# EAGLE design E_Arduino_MEGA2560_ref (EAGLE 6.5.0)
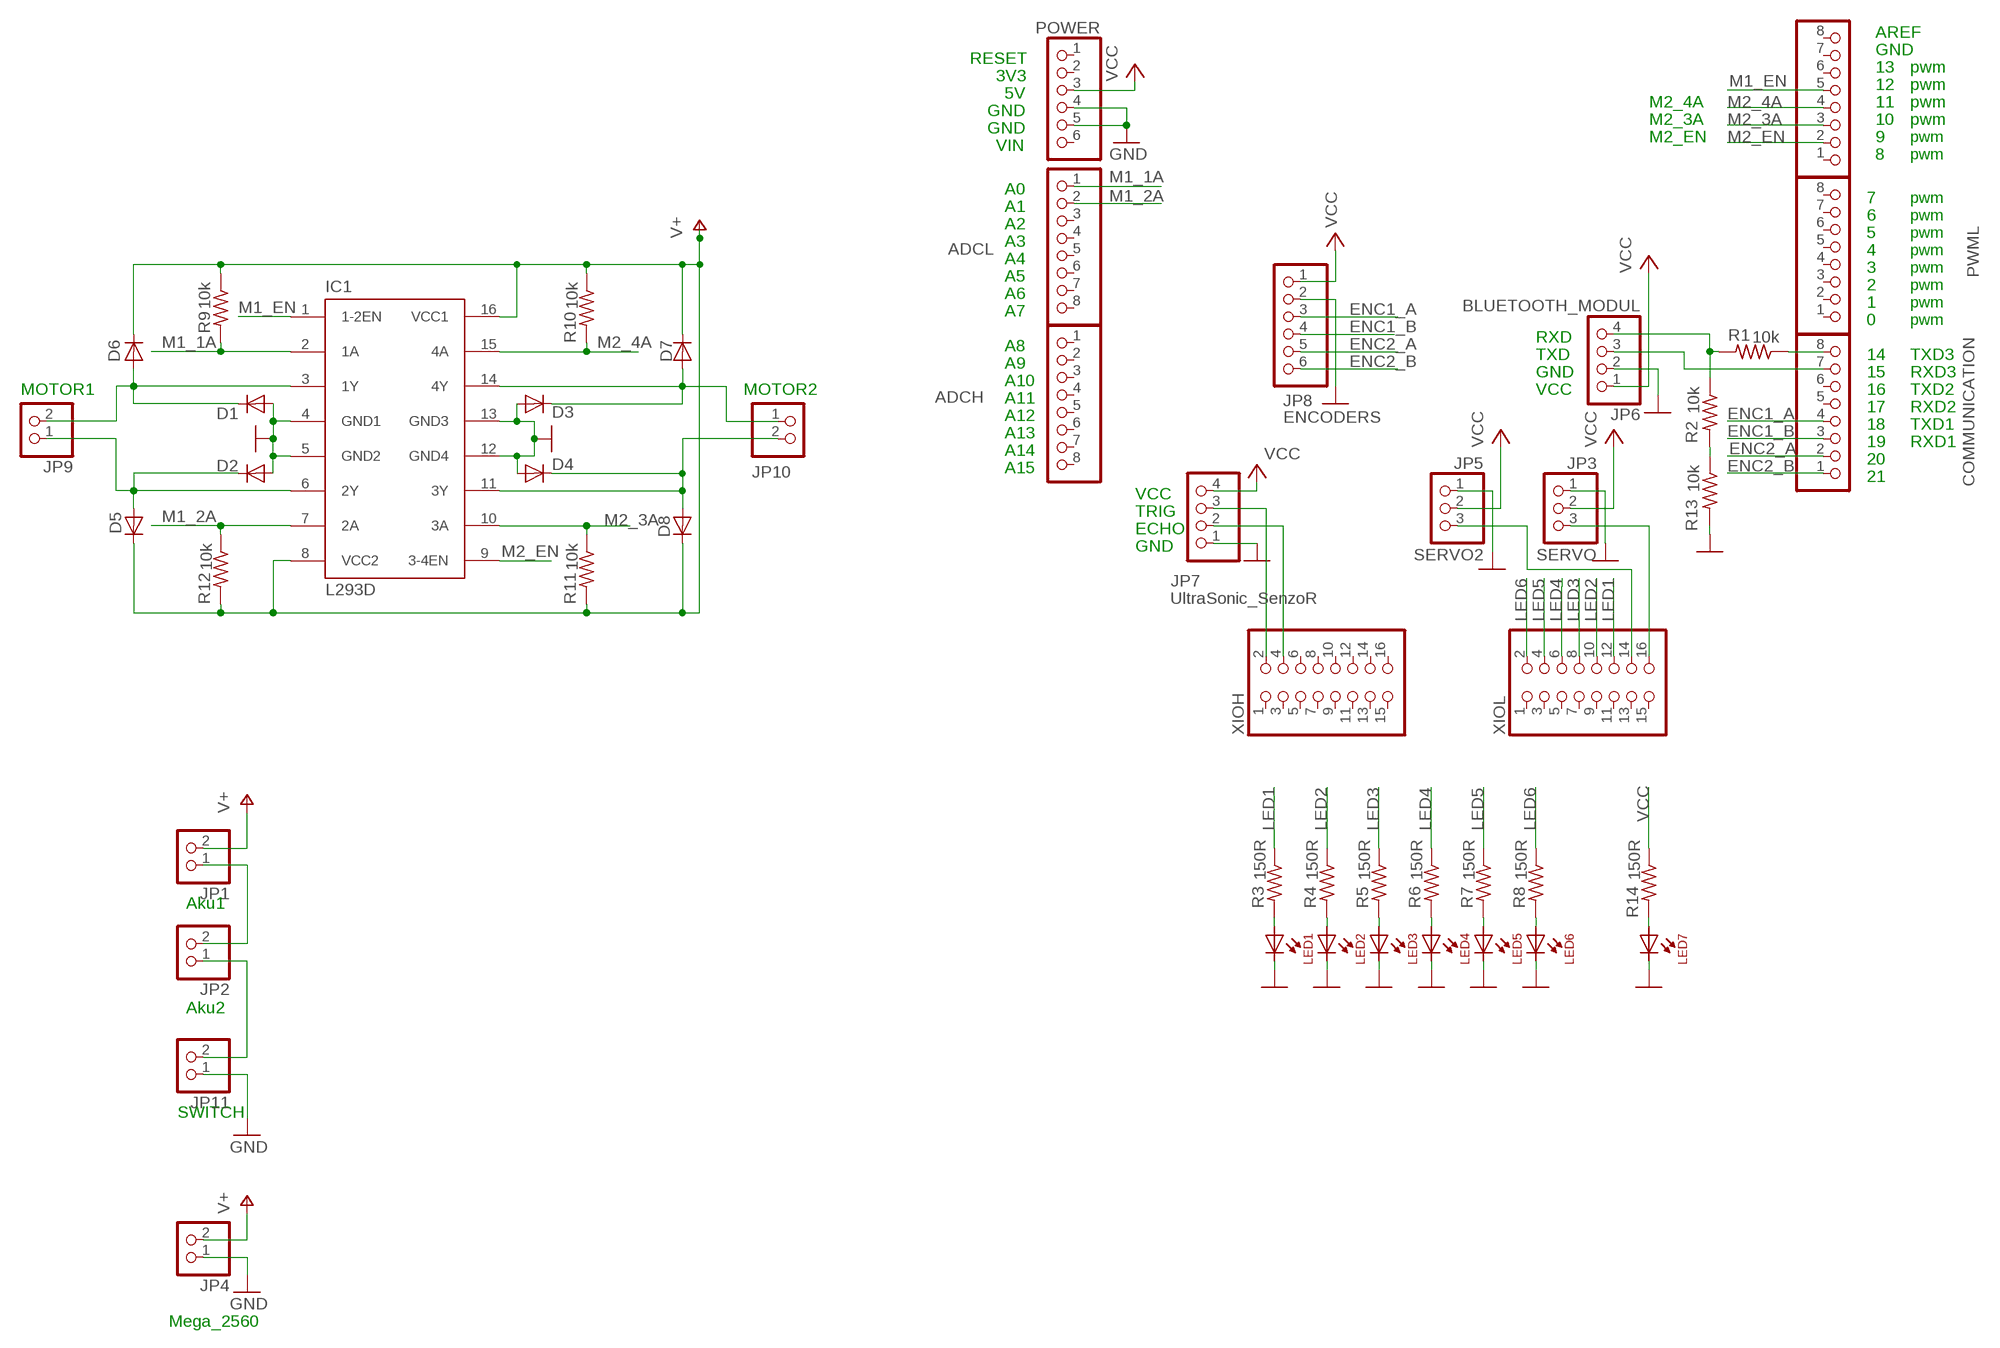
[diagram p0: schematic, sheet 1]

## Parts
ADCH  PINHD-1X8  [1X08]
ADCL  PINHD-1X8  [1X08]
COMMUNICATION  PINHD-1X8  [1X08]
D1  PMLL4150  [SOD80C]
D2  PMLL4150  [SOD80C]
D3  PMLL4150  [SOD80C]
D4  PMLL4150  [SOD80C]
D5  PMLL4150  [SOD80C]
D6  PMLL4150  [SOD80C]
D7  PMLL4150  [SOD80C]
D8  PMLL4150  [SOD80C]
IC1  L293D  [DIL16]
JP1  PINHD-1X2  [1X02]
JP2  PINHD-1X2  [1X02]
JP3  SERVO  PINHD-1X3  [1X03]
JP4  PINHD-1X2  [1X02]
JP5  SERVO2  PINHD-1X3  [1X03]
JP6  BLUETOOTH_MODUL  PINHD-1X4  [1X04]
JP7  UltraSonic_SenzoR  PINHD-1X4  [1X04]
JP8  ENCODERS  PINHD-1X6  [1X06]
JP9  PINHD-1X2  [1X02]
JP10  PINHD-1X2  [1X02]
JP11  PINHD-1X2  [1X02]
LED1  LED_Y_SMD  [LED_Y_SMD]
LED2  LED_Y_SMD  [LED_Y_SMD]
LED3  LED_Y_SMD  [LED_Y_SMD]
LED4  LED_Y_SMD  [LED_Y_SMD]
LED5  LED_Y_SMD  [LED_Y_SMD]
LED6  LED_Y_SMD  [LED_Y_SMD]
LED7  LED_Y_SMD  [LED_Y_SMD]
POWER  PINHD-1X6  [1X06]
PWMH  PINHD-1X8  [1X08]
PWML  PINHD-1X8  [1X08]
R1  10k  R-US_R0805  [R0805]
R2  10k  R-US_R0805  [R0805]
R3  150R  R-US_R0805  [R0805]
R4  150R  R-US_R0805  [R0805]
R5  150R  R-US_R0805  [R0805]
R6  150R  R-US_R0805  [R0805]
R7  150R  R-US_R0805  [R0805]
R8  150R  R-US_R0805  [R0805]
R9  10k  R-US_R0805  [R0805]
R10  10k  R-US_R0805  [R0805]
R11  10k  R-US_R0805  [R0805]
R12  10k  R-US_R0805  [R0805]
R13  10k  R-US_R0805  [R0805]
R14  150R  R-US_R0805  [R0805]
XIOH  PINHD-2X8  [2X08]
XIOL  PINHD-2X8  [2X08]

## Nets
ENC1_A: COMMUNICATION.4 JP8.3
ENC1_B: COMMUNICATION.3 JP8.4
ENC2_A: COMMUNICATION.2 JP8.5
ENC2_B: COMMUNICATION.1 JP8.6
GND [Ground]: D1.A D2.A D3.A D4.A IC1.4(GND1) IC1.5(GND2) IC1.12(GND4) IC1.13(GND3) JP3.1 JP4.1 JP5.1 JP6.2 JP7.1 JP8.2 JP11.1 LED1.CATHODE LED2.CATHODE LED3.CATHODE LED4.CATHODE LED5.CATHODE LED6.CATHODE LED7.CATHODE POWER.4 POWER.5 R13.2
LED1: R3.1 XIOL.12
LED2: R4.1 XIOL.10
LED3: R5.1 XIOL.8
LED4: R6.1 XIOL.6
LED5: R7.1 XIOL.4
LED6: R8.1 XIOL.2
M1_1A: ADCL.1 IC1.2(1A) R9.2
M1_2A: ADCL.2 IC1.7(2A) R12.1
M1_EN: IC1.1(1-2EN) PWMH.5
M2_3A: IC1.10(3A) PWMH.3 R11.1
M2_4A: IC1.15(4A) PWMH.4 R10.2
M2_EN: IC1.9(3-4EN) PWMH.2
N$1: D1.C D6.A IC1.3(1Y) JP9.2
N$2: D2.C D5.A IC1.6(2Y) JP9.1
N$3: D3.C D7.A IC1.14(4Y) JP10.1
N$4: D4.C D8.A IC1.11(3Y) JP10.2
N$5: JP3.3 XIOL.16
N$6: COMMUNICATION.7 JP6.3
N$7: COMMUNICATION.8 R1.1
N$8: JP6.4 R1.2 R2.1
N$9: R2.2 R13.1
N$10: JP7.2 XIOH.4
N$11: JP7.3 XIOH.2
N$12: LED1.ANODE R3.2
N$13: LED2.ANODE R4.2
N$14: LED3.ANODE R5.2
N$15: LED4.ANODE R6.2
N$16: LED5.ANODE R7.2
N$17: LED6.ANODE R8.2
N$18: JP5.3 XIOL.14
N$19: LED7.ANODE R14.2
N$20 [Ground]: JP1.1 JP2.2
N$21 [Ground]: JP2.1 JP11.2
V+ [VCC_]: D5.C D6.C D7.C D8.C IC1.8(VCC2) IC1.16(VCC1) JP1.2 JP4.2 R9.1 R10.1 R11.2 R12.2
VCC [VCC_]: JP3.2 JP5.2 JP6.1 JP7.4 JP8.1 POWER.3 R14.1
Unconnected: ADCH.1 ADCH.2 ADCH.3 ADCH.4 ADCH.5 ADCH.6 ADCH.7 ADCH.8 ADCL.3 ADCL.4 ADCL.5 ADCL.6 ADCL.7 ADCL.8 COMMUNICATION.5 COMMUNICATION.6 POWER.1 POWER.2 POWER.6 PWMH.1 PWMH.6 PWMH.7 PWMH.8 PWML.1 PWML.2 PWML.3 PWML.4 PWML.5 PWML.6 PWML.7 PWML.8 XIOH.1 XIOH.3 XIOH.5 XIOH.6 XIOH.7 XIOH.8 XIOH.9 XIOH.10 XIOH.11 XIOH.12 XIOH.13 XIOH.14 XIOH.15 XIOH.16 XIOL.1 XIOL.3 XIOL.5 XIOL.7 XIOL.9 XIOL.11 XIOL.13 XIOL.15

## Notes on the sheet
- AREF
- GND
- RESET
- 13 | pwm
- 3V3
- 12 | pwm
- 5V
- M2_4A | 11 | pwm
- GND
- M2_3A | 10 | pwm
- GND
- M2_EN | 9 | pwm
- VIN
- 8 | pwm
- A0
- 7 | pwm
- A1
- 6 | pwm
- A2
- 5 | pwm
- A3
- 4 | pwm
- A4
- 3 | pwm
- A5
- 2 | pwm
- A6
- 1 | pwm
- A7
- 0 | pwm
- RXD
- A8
- TXD | 14 | TXD3
- A9
- GND | 15 | RXD3
- A10
- MOTOR1 | MOTOR2 | VCC | 16 | TXD2
- A11
- 17 | RXD2
- A12
- 18 | TXD1
- A13
- 19 | RXD1
- A14
- 20
- A15
- 21
- VCC
- TRIG
- ECHO
- GND
- Aku1
- Aku2
- SWITCH
- Mega_2560

## Library data of the parts
ADCH ADCL COMMUNICATION PWMH PWML = pinhead:PINHD-1X8: PIN HEADER
D1-D8 = diode:PMLL4150: DIODE high speed
IC1 = st-microelectronics:L293D: PUSH-PULL 4 CHANNEL DRIVER; MPN: L293D; OC_FARNELL: 9589619; OC_NEWARK: 56P8249
JP1 JP2 JP4 JP9-JP11 = pinhead:PINHD-1X2: PIN HEADER
JP3 JP5 = pinhead:PINHD-1X3: PIN HEADER
JP6 JP7 = pinhead:PINHD-1X4: PIN HEADER
JP8 POWER = pinhead:PINHD-1X6: PIN HEADER
LED1-LED7 = my_lib:LED_Y_SMD
R1-R14 = adafruit:R-US_: RESISTOR, American symbol
XIOH XIOL = pinhead:PINHD-2X8: PIN HEADER

## Net classes
0 default: width 0.508 mm, drill 20 mm, clearance 0.2 mm
1 Ground: width 1.016 mm, drill 20 mm, clearance 0.2 mm
2 VCC_: width 1.016 mm, drill 20 mm, clearance 0.2 mm

## Board
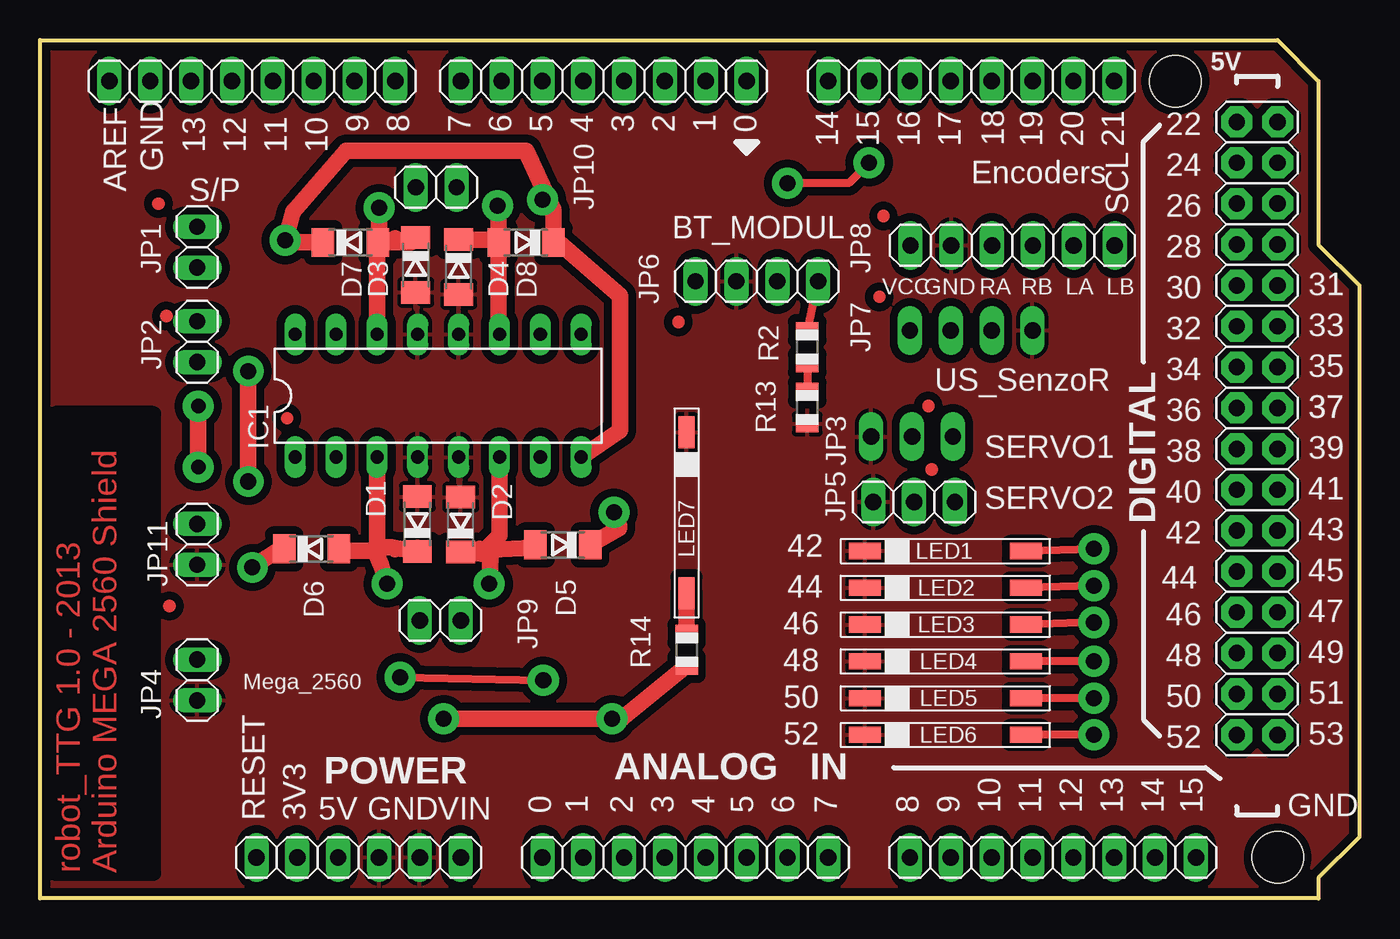
[diagram p1: board, top side]
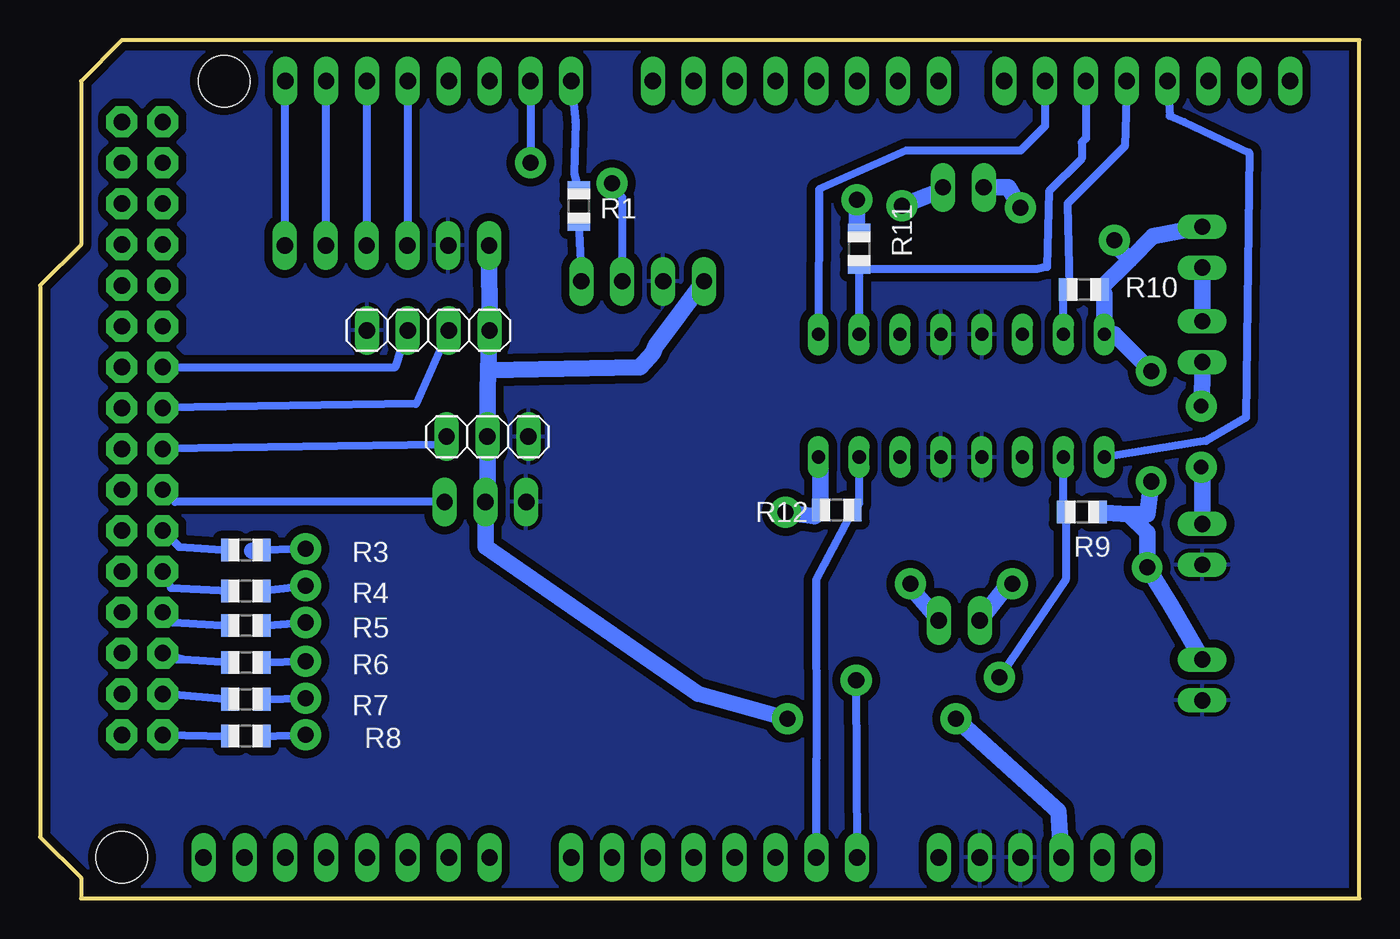
[diagram p2: board, bottom side, seen from below]

Size 82.03 x 53.34 mm. Coordinates in mm from the lower left corner, seen from the top.
Outline: 0,53.34 76.95,53.34 79.49,50.8 79.49,40.64 82.03,38.1 82.03,3.81 79.49,1.27 79.49,0 0,0 0,53.34
Copper layers (1*16): Top 0.035mm / dielectric 1.5mm / Bottom 0.035mm
Design rules "default *": minimum track width 6mil, minimum drill 20mil, track to track 0.5mm, track to pad 0.8mm, pad to pad 0.2mm, via to via 0.2mm, smd to smd 0.2mm, copper to edge 20mil, drill to drill 0.9mm, minimum pad ring 10mil, minimum via ring 10mil, stop-mask expansion 2mil, vias tented up to drill 1mil, thermal gap 10mil
Holes 3.2 mm at 76.95,2.54 -4.33,50.8 70.6,50.8 -12.46,0.25

### Footprints (pad centres in the part's own frame; a part is rotated, then mirrored left to right if it is on the bottom)
1X08 = drill 1.016 long: 1 -8.89,0; 2 -6.35,0; 3 -3.81,0; 4 -1.27,0; 5 1.27,0; 6 3.81,0; 7 6.35,0; 8 8.89,0
SOD80C = smd 1.4 x 1.8: A 1.7,0; C -1.7,0
DIL16 = drill 0.813 long: 1 -8.89,-3.81; 2 -6.35,-3.81; 3 -3.81,-3.81; 4 -1.27,-3.81; 5 1.27,-3.81; 6 3.81,-3.81; 7 6.35,-3.81; 8 8.89,-3.81; 9 8.89,3.81; 10 6.35,3.81; 11 3.81,3.81; 12 1.27,3.81; 13 -1.27,3.81; 14 -3.81,3.81; 15 -6.35,3.81; 16 -8.89,3.81
1X02 = drill 1.016 long: 1 -1.27,0; 2 1.27,0
1X03 = drill 1.016 long: 1 -2.54,0; 2 0,0; 3 2.54,0
1X04 = drill 1.016 long: 1 -3.81,0; 2 -1.27,0; 3 1.27,0; 4 3.81,0
1X06 = drill 1.016 long: 1 -6.35,0; 2 -3.81,0; 3 -1.27,0; 4 1.27,0; 5 3.81,0; 6 6.35,0
LED_Y_SMD = smd 1 x 2: ANODE 0,-10; CATHODE 0,0
R0805 = smd 1.1 x 1.4: 1 -1,0; 2 1,0
2X08 = drill 1.016 pad 1.93 octagon: 1 -8.89,-1.27; 2 -8.89,1.27; 3 -6.35,-1.27; 4 -6.35,1.27; 5 -3.81,-1.27; 6 -3.81,1.27; 7 -1.27,-1.27; 8 -1.27,1.27; 9 1.27,-1.27; 10 1.27,1.27; 11 3.81,-1.27; 12 3.81,1.27; 13 6.35,-1.27; 14 6.35,1.27; 15 8.89,-1.27; 16 8.89,1.27

### Placement (x,y rotation side)
ADCH  62.98,2.54 0 top
ADCL  40.12,2.54 0 top
COMMUNICATION  57.9,50.8 180 top
D1  23.45,23.27 90 top
D2  26.15,23.24 90 top
D3  23.35,39.37 270 top
D4  26.02,39.24 270 top
D5  32.5,21.97 180 top
D6  16.87,21.72 0 top
D7  19.29,40.77 0 top
D8  30.21,40.77 180 top
IC1  24.75,31.24 0 top
JP1  9.76,40.48 90 top
JP2  9.76,34.6 90 top
JP3  54.21,28.7 180 bottom
JP4  9.76,13.57 90 top
JP5  54.34,24.64 0 top
JP6  44.56,38.35 0 top
JP7  57.9,35.31 0 bottom
JP8  60.46,40.59 0 top
JP9  24.88,17.27 180 top
JP10  24.62,44.2 0 top
JP11  9.76,22 90 top
LED1  51.29,21.59 90 top
LED2  51.29,19.3 90 top
LED3  51.29,17.02 90 top
LED4  51.29,14.73 90 top
LED5  51.29,12.45 90 top
LED6  51.29,10.16 90 top
LED7  40.19,28.96 0 top
POWER  19.8,2.54 0 top
PWMH  13.19,50.8 180 top
PWML  35.04,50.8 180 top
R1  48.54,43.03 270 bottom
R2  47.7,34.26 270 top
R3  69.23,21.64 0 bottom
R4  69.23,19.1 0 bottom
R5  69.23,16.95 0 bottom
R6  69.23,14.66 0 bottom
R7  69.23,12.37 0 bottom
R8  69.23,10.09 0 bottom
R9  17.26,24 180 bottom
R10  17.13,37.85 180 bottom
R11  31.1,40.39 90 bottom
R12  32.5,24.13 180 bottom
R13  47.7,30.51 270 top
R14  40.19,15.45 90 top
XIOH  75.68,39.37 90 top
XIOL  75.68,19.05 90 top

### Tracks (layer width: path | path; a pad name or v marks a point on that pad's centre or on a via)
ENC1_A
  Bottom 0.508: COMMUNICATION.4 59.17,50.11 JP8.3
ENC1_B
  Bottom 0.508: COMMUNICATION.3 61.73,50.77 JP8.4
ENC2_A
  Bottom 0.508: COMMUNICATION.2 64.27,50.77 JP8.5
ENC2_B
  Bottom 0.508: COMMUNICATION.1 66.81,50.77 JP8.6
GND
  pour Top (isolate 0.305, rank 2): 84.19,54.99 84.31,-1.65 2.78,-1.14 -0.27,-1.27 -0.52,55.24
  pour Bottom (isolate 0.356, rank 2): 84.19,54.86 84.44,-1.65 -0.52,-1.14 -0.4,0.13 -0.27,49.53 -0.52,55.24
LED1
  Bottom 0.508: XIOL.12 73.39,21.84 R3.1
LED2
  Bottom 0.508: XIOL.10 73.9,19.3 R4.1
LED3
  Bottom 0.508: XIOL.8 73.77,17.14 R5.1
LED4
  Bottom 0.508: XIOL.6 73.14,14.86 | 73.52,14.86 73.14,14.86 | 73.14,14.86 R6.1
LED5
  Bottom 0.508: XIOL.4 74.03,12.7 R7.1
LED6
  Bottom 0.508: XIOL.2 R8.1
M1_1A  (via drill 1 pad 1.93)
  Top 0.508: v22.39,13.75 v31.29,13.55
  Bottom 0.508: IC1.2 18.4,24.15 R9.2 18.26,19.83 v22.39,13.75 | v31.29,13.55 ADCL.1
M1_2A
  Bottom 0.508: IC1.7 31.1,24.53 R12.1 33.78,19.8 33.77,8.64 ADCL.2
M1_EN
  Bottom 0.508: PWMH.5 11.79,48.64 10.91,48.26 6.84,46.35 7.04,29.88 9.53,28.43 IC1.1
M2_3A
  Bottom 0.508: PWMH.3 17,47.24 17.26,46.99 17.26,45.97 19.29,43.94 19.41,39.24 20.05,39.12 30.83,39.12 R11.1 IC1.10
M2_4A
  Bottom 0.508: IC1.15 18.4,37.58 R10.2 18.02,37.96 18.14,43.18 14.59,46.74 PWMH.4
M2_EN
  Bottom 0.508: PWMH.2 19.54,48.01 21.07,46.48 28.18,46.48 33.58,44.07 IC1.9
N$1  (via drill 1 pad 1.93)
  Top 0.508: 18.53,21.59 D6.A
  Top 1.016: D1.C 22.15,21.77 | 22.15,21.77 21.85,21.82 21.23,21.84 20.94,21.29 | 23.48,21.8 D1.C | 18.53,21.59 20.74,21.59 20.94,21.29 | 23.34,21.45 D1.C | 22.07,21.69 22.15,21.77 | IC1.3 20.94,21.29 | v21.57,19.56 21.19,20.7 20.94,21.29
  Bottom 1.016: JP9.2 21.83,19.56 v21.57,19.56
N$2  (via drill 1 pad 1.93)
  Top 1.016: 27.42,21.41 D2.C 26.07,21.46 | 27.42,21.41 28.05,21.67 | 28.05,21.67 30.62,21.8 D5.A | IC1.6 28.56,22.56 27.42,21.41 | 27.34,21.71 27.42,21.41 | v27.92,19.56 28.05,21.67
  Bottom 1.016: JP9.1 27.67,19.05 v27.92,19.56
N$3  (via drill 1 pad 1.93)
  Top 1.016: IC1.14 20.94,40.72 D7.A | D7.A 22.34,40.77 | 22.34,40.77 23.05,40.77 D3.C | 22.07,41.04 22.34,40.77 | v21.07,42.93 21.07,40.84 D7.A
  Bottom 1.016: JP10.1 21.83,44.2 v21.07,42.93
N$4  (via drill 1 pad 1.93)
  Top 0.508: 26.02,40.77 D4.C
  Top 1.016: 25.89,41.07 D4.C | D4.C 28.33,40.94 D8.A | D8.A 28.51,35.1 IC1.11 | 26.07,40.99 D4.C | v28.43,43.05 28.51,42.85 D8.A
  Bottom 1.016: JP10.2 arc90 26.15,43.94 v28.43,43.05
N$5
  Bottom 0.508: JP3.3 57.01,28.19 XIOL.16
N$6  (via drill 1 pad 1.93)
  Top 0.508: v51.55,45.72 50.28,44.45 v46.47,44.45
  Bottom 0.508: COMMUNICATION.7 v51.55,45.72 | v46.47,44.45 45.83,43.56 JP6.3
N$7
  Bottom 0.508: COMMUNICATION.8 48.75,48.26 48.82,45.05 R1.1
N$8
  Top 0.508: R2.1 JP6.4
  Bottom 0.508: R1.2 JP6.4
N$9
  Top 0.508: R2.2 R13.1
N$10
  Bottom 0.508: XIOH.4 59.93,33.02 JP7.2
N$11
  Bottom 0.508: JP7.3 58.66,30.73 XIOH.2
N$12  (via drill 1 pad 1.93)
  Top 0.508: LED1.ANODE v65.52,21.72
  Bottom 0.508: v65.52,21.72 68.83,21.59
  Bottom 1.016: 68.83,21.59 R3.2
N$13  (via drill 1 pad 1.93)
  Top 0.508: v65.52,19.43 LED2.ANODE
  Bottom 0.508: R4.2 v65.52,19.43
N$14  (via drill 1 pad 1.93)
  Top 0.508: v65.52,17.14 LED3.ANODE
  Bottom 0.508: R5.2 v65.52,17.14
N$15  (via drill 1 pad 1.93)
  Top 0.508: v65.52,14.73 LED4.ANODE
  Bottom 0.508: R6.2 v65.52,14.73
N$16  (via drill 1 pad 1.93)
  Top 0.508: v65.52,12.45 LED5.ANODE
  Bottom 0.508: R7.2 v65.52,12.45
N$17  (via drill 1 pad 1.93)
  Top 0.508: v65.52,10.16 LED6.ANODE
  Bottom 0.508: R8.2 v65.52,10.16
N$18
  Bottom 0.508: JP5.3 73.64,24.64 XIOL.14
N$19
  Top 1.016: LED7.ANODE R14.2
N$20
  Bottom 1.016: JP1.1 JP2.2
N$21  (via drill 0.9 pad 1.93)
  Top 1.016: v9.83,30.6 v9.83,26.8
  Bottom 1.016: JP2.1 9.76,32.26 v9.83,30.6 | v9.83,26.8 9.76,25.94 JP11.2
V+  (via drill 1 pad 1.9, 1 pad 1.93)
  Top 1.016: IC1.8 35.99,29.02 36.05,29.08 36.05,37.47 32.24,40.77 D8.C 31.91,42.75 31.73,43.15 | D5.C 35.99,23 35.99,23.18 v35.67,24 | D6.C 15.18,21.89 v13.19,20.57 | v12.94,32.77 v12.94,25.91 | D7.C 15.86,40.77 v15.22,40.89 15.73,42.67 19.03,46.48 30.21,46.48 31.73,43.15 | v31.23,43.43 31.71,43.15 31.73,43.15
  Bottom 1.016: IC1.8 33.5,27.29 R12.2 33.88,23.75 v35.67,24 | R9.1 14.35,23.88 | v12.94,32.77 15.22,35.05 IC1.16 15.86,37.58 R10.1 14.28,39.7 | v12.94,25.91 13.19,23.88 14.35,23.88 | JP1.2 12.83,41.15 14.28,39.7 | v15.22,40.89 15.48,40.89 14.28,39.7 | JP4.2 11.72,18.23 12.67,19.77 v13.19,20.57 13.19,22.72 14.35,23.88 | R11.2 31.23,41.51 v31.23,43.43
VCC  (via drill 1 pad 1.93)
  Top 1.016: v25.08,11.16 v35.56,11.16 36.16,11.18 R14.1
  Bottom 1.016: JP7.4 54.21,35.18 | JP8.1 JP7.4 | 54.17,32.81 54.21,31.37 JP3.2 54.21,24.89 JP5.2 54.34,21.84 41.13,12.7 v35.56,11.16 | 54.17,32.81 JP7.4 | v25.08,11.16 18.73,5.41 POWER.3 | JP6.1 43.75,34.33 43.93,33.9 44.71,33.01 54.17,32.81
(copper drawn outside any net)
  shapes: Top circle x9

### Text on the board
Top: robot_TTG 1.0 - 2013 / Arduino MEGA 2560 Shield
tPlace: 18 | 9 | 8 | 7 | 6 | 5 | 4 | 3 | 2 | 1 | 0 | 14 | 15 | 16 | 17 | 19 | 20 | 21 | 22 | 13 | 12 | 11 | 10 | Encoders | 24 | BT_MODUL | 26 | 28 | VCC | GND | RA | RB | LA | LB | 30 | 31 | 32 | 33 | US_SenzoR | 34 | 35 | 36 | 37 | 37 | SERVO1 | 38 | 39 | SERVO2 | LED7 | 40 | 41 | LED1 | 42 | 43 | 42 | LED2 | 45 | 44 | 44 | LED3 | 46 | 47 | 46 | LED4 | 49 | Mega_2560 | 48 | 48 | LED5 | 50 | 50 | 51 | LED6 | 52 | 53 | 52 | 0 | 1 | 2 | 3 | 4 | 5 | 6 | 7 | 8 | 9 | 10 | 11 | 12 | 13 | 14 | 15
tNames: 5V | GND | S/P | AREF | SCL | DIGITAL | ANALOG IN | RESET | 3V3 | 5V | GND | VIN | GND
ReferenceLC: L | TX | RX | PC1 | PC2